# Altium schematic sheet MCU.SchDoc: =ProjectTitle
size 297 x 209 mm; Address1: Address1; Address2: Address2; Address3: Address3; Address4: Address4; SheetNumber: 2; SheetTotal: 7; Scale: 1:1; DocumentType: Схема электрическая принципиальная
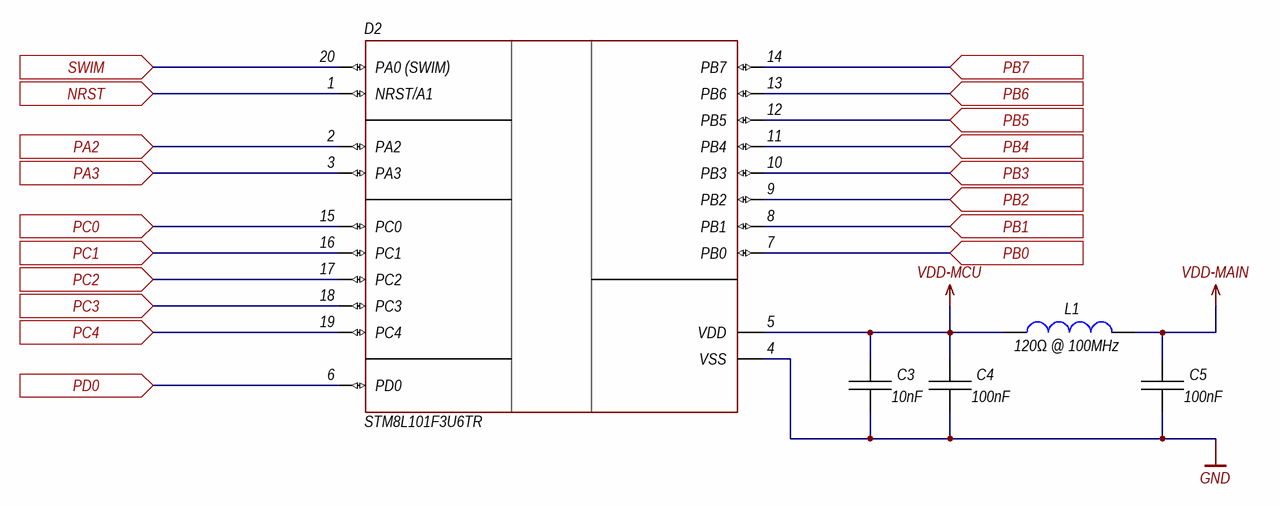
[diagram p0: MCU.SchDoc]

## Parts
C3  10nF  [CH0402C]
C4  100nF  [CH0402C]
C5  100nF  [CH0402C]
D2  STM8L101F3U6TR  [20-UFQFPN]
L1  120Ω @ 100MHz  [CH0402L]

## Ports
NRST (in), PA2 (in), PA3 (in), PB0 (in), PB1 (in), PB2 (in), PB3 (in), PB4 (in), PB5 (in), PB6 (in), PB7 (in), PC0 (in), PC1 (in), PC2 (in), PC3 (in), PC4 (in), PD0 (in), SWIM (in)

## Nets
GND: C3.1 C4.1 C5.1 D2.4(VSS)
VDD-MAIN: C5.2 L1.1
VDD-MCU: C3.2 C4.2 D2.5(VDD) L1.2
NRST: D2.1(NRST/A1) ; port NRST
PA2: D2.2(PA2) ; port PA2
PA3: D2.3(PA3) ; port PA3
PB0: D2.7(PB0) ; port PB0
PB1: D2.8(PB1) ; port PB1
PB2: D2.9(PB2) ; port PB2
PB3: D2.10(PB3) ; port PB3
PB4: D2.11(PB4) ; port PB4
PB5: D2.12(PB5) ; port PB5
PB6: D2.13(PB6) ; port PB6
PB7: D2.14(PB7) ; port PB7
PC0: D2.15(PC0) ; port PC0
PC1: D2.16(PC1) ; port PC1
PC2: D2.17(PC2) ; port PC2
PC3: D2.18(PC3) ; port PC3
PC4: D2.19(PC4) ; port PC4
PD0: D2.6(PD0) ; port PD0
SWIM: D2.20(PA0_(SWIM)) ; port SWIM

## Notes on the sheet
- Изм.
- Лист
- № докум.
- Подп.
- Дата
- Копировал
- Формат А4

## Library data of the parts
C3-C5 = Capacitor: Manufacturer: *; Model: *; HelpURL: *; ComponentKind: *
  C3: Value: 10nF
  C4 C5: Value: 100nF
D2 = STM8L101F3U6: STM8; Manufacturer: ST Microelectronics; Model: STM8L101F3U6TR; ComponentKind: UFQFPN20, 1.65-3.6V, 16MHz, 1.5Kb RAM, 2Kb Flash; HelpURL: https://lcsc.com/product-detail/ST-Microelectronics_STMicroelectronics-STM8L101F3U6TR_C111168.html
L1 = Inductor: Manufacturer: *; Model: *; HelpURL: *; ComponentKind: *; Value: 120Ω @ 100MHz